# EasyEDA schematic Amp2.json
TITLE: Sheet_1; REV: 1.0; Date: 2024-01-01; Sheet: 1/1; Company: Your Company
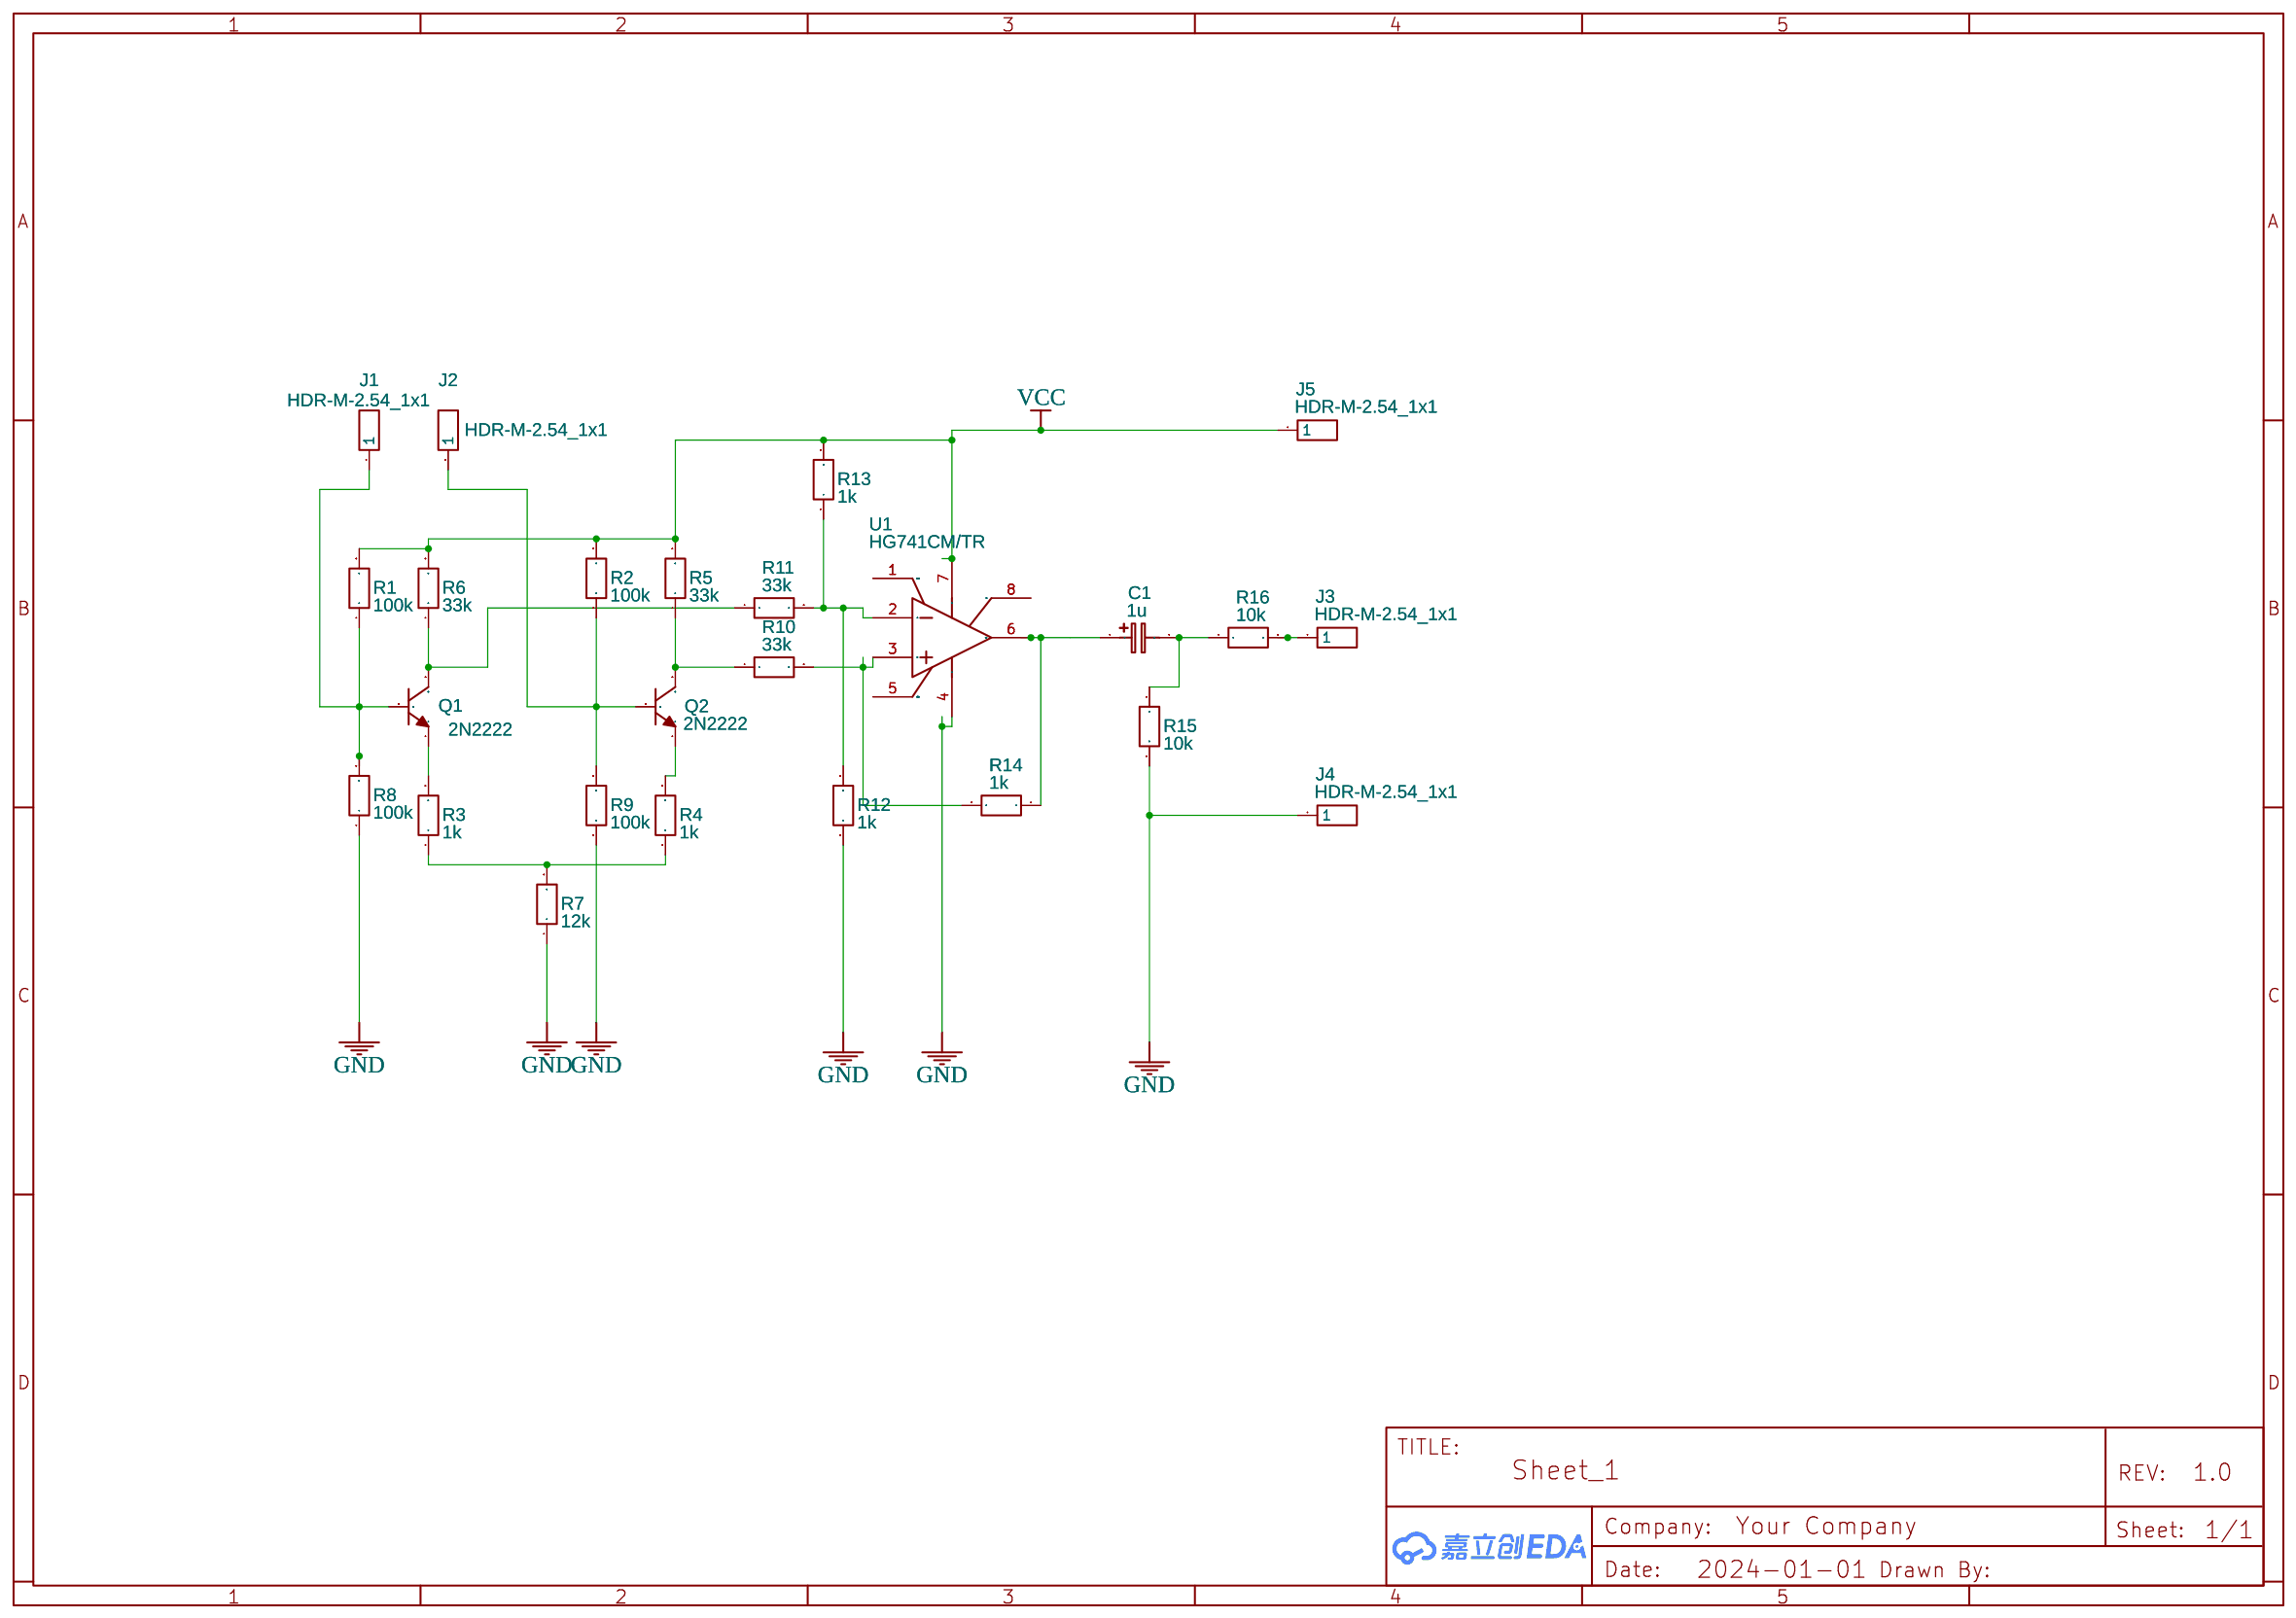
[diagram p0: schematic sheet]

## Parts
C1  1u  [CASE-A_3216]
J1  HDR-M-2.54_1x1  [HDR-M-2.54_1X1]
J2  HDR-M-2.54_1x1  [HDR-M-2.54_1X1]
J3  HDR-M-2.54_1x1  [HDR-M-2.54_1X1]
J4  HDR-M-2.54_1x1  [HDR-M-2.54_1X1]
J5  HDR-M-2.54_1x1  [HDR-M-2.54_1X1]
Q1  2N2222  [SOT-23-3_L2.9-W1.3-P1.90-LS2.4-TR]
Q2  2N2222  [SOT-23-3_L2.9-W1.3-P1.90-LS2.4-TR]
R1  100k  [R0603]
R2  100k  [R0603]
R3  1k  [R0603]
R4  1k  [R0603]
R5  33k  [R0603]
R6  33k  [R0603]
R7  12k  [R0603]
R8  100k  [R0603]
R9  100k  [R0603]
R10  33k  [R0603]
R11  33k  [R0603]
R12  1k  [R0603]
R13  1k  [R0603]
R14  1k  [R0603]
R15  10k  [R0603]
R16  10k  [R0603]
U1  HG741CM/TR  [SOP-8_L5.0-W3.9-P1.27-LS6.0-BL]

## Library data of the parts
C1 = C_Tan_SMD_A_EU: Contributor: LCEDA_Lib
J1-J5 = HDR-M-2.54_1x1: Supplier Part: C81276; Supplier: LCSC; Contributor: LCEDA_Lib
Q1 Q2 = 2N3904(SOT-23): Supplier: LCSC; Manufacturer: KEC; Manufacturer Part: 2n3904S-RTK/PS; Supplier Part: C18536; Paste Type: SOT-23; Contributor: LCEDA_Lib
R1-R16 = R_0603_EU: Contributor: LCEDA_Lib
U1 = HG741CM/TR: Contributor: lcsc; Supplier: LCSC; Supplier Part: C2926357; Manufacturer: HGSEMI(华冠); JLCPCB Part Class: Extended Part

## Nets
GND: J4.1 R7.1 R8.1 R9.1 R12.1 R15.2 U1.4(V-)
VCC: J5.1 R1.2 R2.2 R5.2 R6.2 R13.2 U1.7(V+)
Net-(C1-1): C1.1 R14.1 U1.6(OUTPUT)
Net-(C1-2): C1.2 R15.1 R16.1
Net-(J1-1): J1.1 Q1.2(B) R1.1 R8.2
Net-(J2-1): J2.1 Q2.2(B) R2.1 R9.2
Net-(J3-1): J3.1 R16.2
Net-(Q1-1): Q1.1(E) R3.2
Net-(Q1-3): Q1.3(C) R6.1 R11.1
Net-(Q2-1): Q2.1(E) R4.2
Net-(Q2-3): Q2.3(C) R5.1 R10.1
Net-(R3-1): R3.1 R4.1 R7.2
Net-(R10-2): R10.2 R14.2 U1.3(+IN)
Net-(R11-2): R11.2 R12.2 R13.1 U1.2(-IN)

Not connected (* = marked no-connect by the designer): U1 1(OFFSET NULL) 5(OFFSET NULL) 8(NC)
